# EAGLE design Pod (EAGLE 5.11)
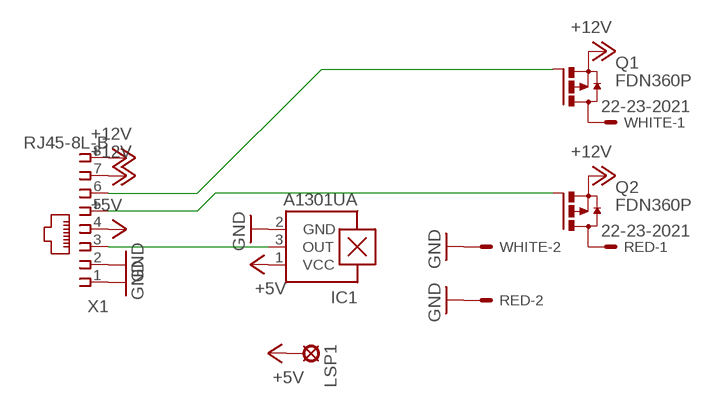
[diagram p0: schematic, sheet 1]

## Parts
IC1  A1301UA  [SIP3-UA]
LSP1  LSP10  [LSP10]
Q1  FDN360P  [SUPER-SOT3]
Q2  FDN360P  [SUPER-SOT3]
RED  22-23-2021  [22-23-2021]
WHITE  22-23-2021  [22-23-2021]
X1  RJ45-8L-B  [RJ45-NO-SHIELD]

## Nets
+5V: IC1.1(VCC) LSP1.MP X1.4
+12V: Q1.2(S) Q2.2(S) X1.7 X1.8
GND: IC1.2(GND) RED.2 WHITE.2 X1.1 X1.2
N$1: IC1.3(OUT) X1.3
N$2: Q1.3(D) WHITE.1
N$3: Q2.3(D) RED.1
N$4: Q1.1(G) X1.6
N$5: Q2.1(G) X1.5

## Library data of the parts
IC1 = allegro:A13*?: Linear Hall Effect Sensor ICs Continuous-Time Ratiometric High-Temperature Operation Programmable Linear with Analog Output A1302 -Replacement- UGN3503 Source: http://www.allegromicro.com/en/Products/Part_Numbers/1301/1301.pdf http://www.allegromicro.com/en/Products/Part_Numbers/1321/1321.pdf http://www.allegromicro.com/en/Products/Part_Numbers/1381/1381.pdf; MF: ALLEGRO MICROSYSTEMS, INC.; MPN: A1301EUA-T; OC_FARNELL: 1198085; OC_NEWARK: 31K6635
LSP1 = solpad:LSP10: SOLDER PAD drill 1.0 mm, distributor Buerklin, 12H555
Q1 Q2 = transistor-power:FDN360P: Single P-Channel, PowerTrench (R) MOSFET Source: http://www.fairchildsemi.com/ds/FD/FDN360P.pdf
RED WHITE = con-molex:22-23-2021: .100" (2.54mm) Center Header - 2 Pin; MF: MOLEX; MPN: 22-23-2021; OC_FARNELL: 1462926; OC_NEWARK: 25C3832
X1 = con-tycoelectronics:RJ45: CORCOM Modular RJ Jacks No Shield Source: www.tycoelectronics.com .. ENG_DS_1654001_1099_RJ_L_0507.pdf; MF: TYCO ELECTRONICS; MPN: RJ45-8L-B; OC_FARNELL: 1279843; OC_NEWARK: 52K4445

## Board
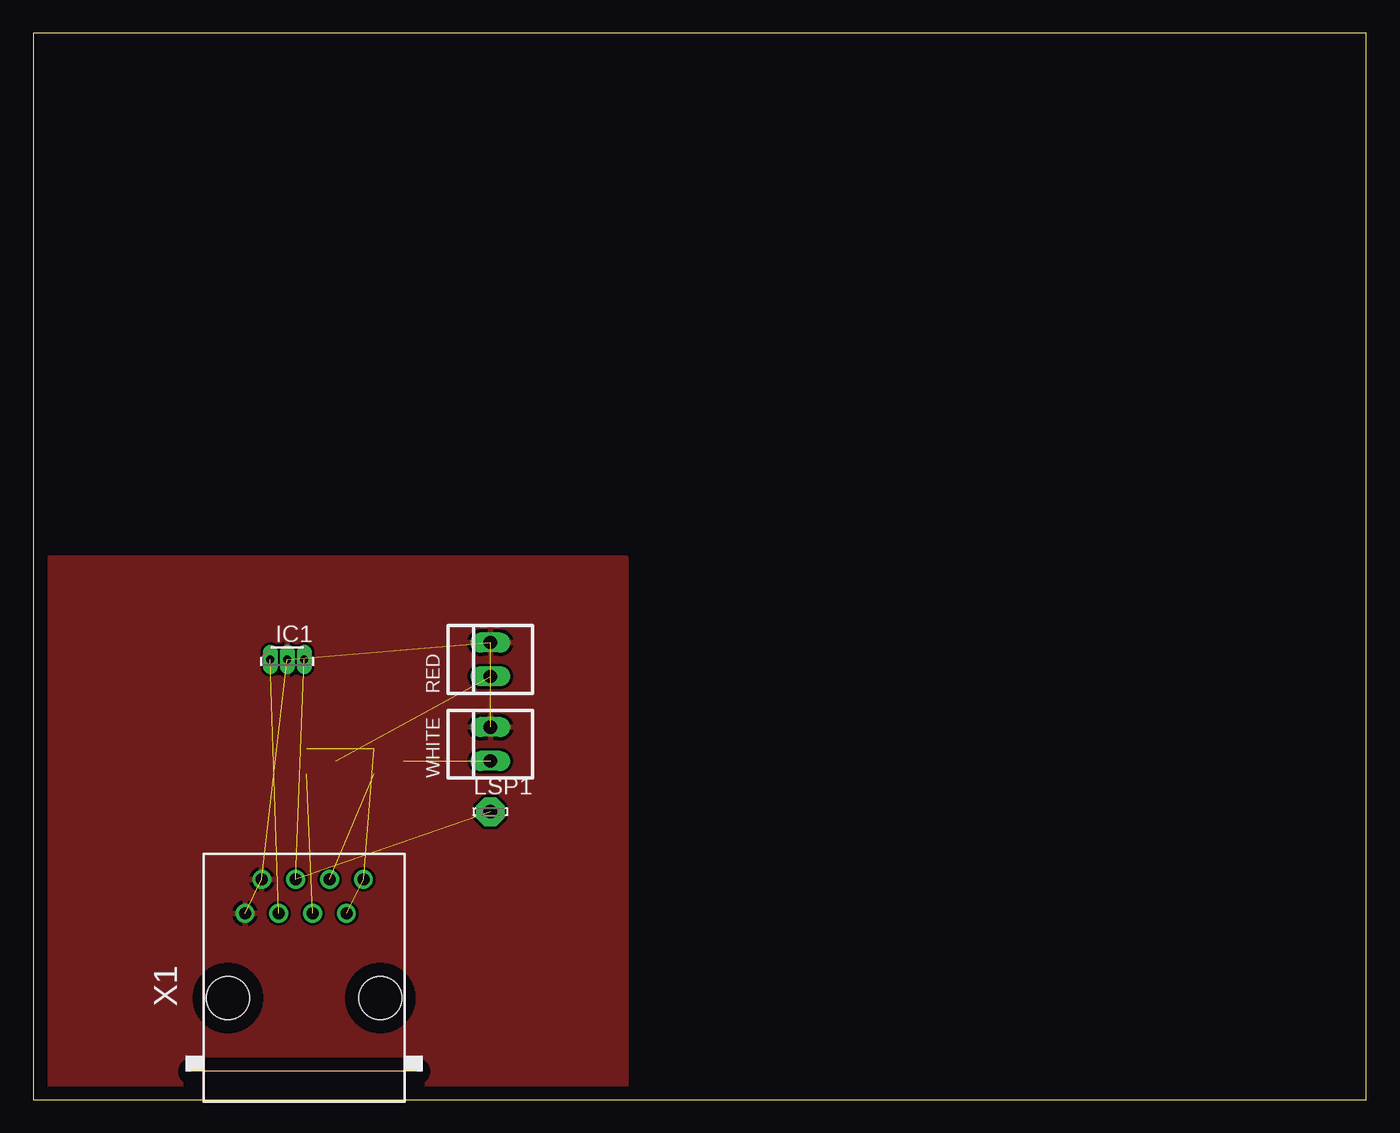
[diagram p1: board, top side]
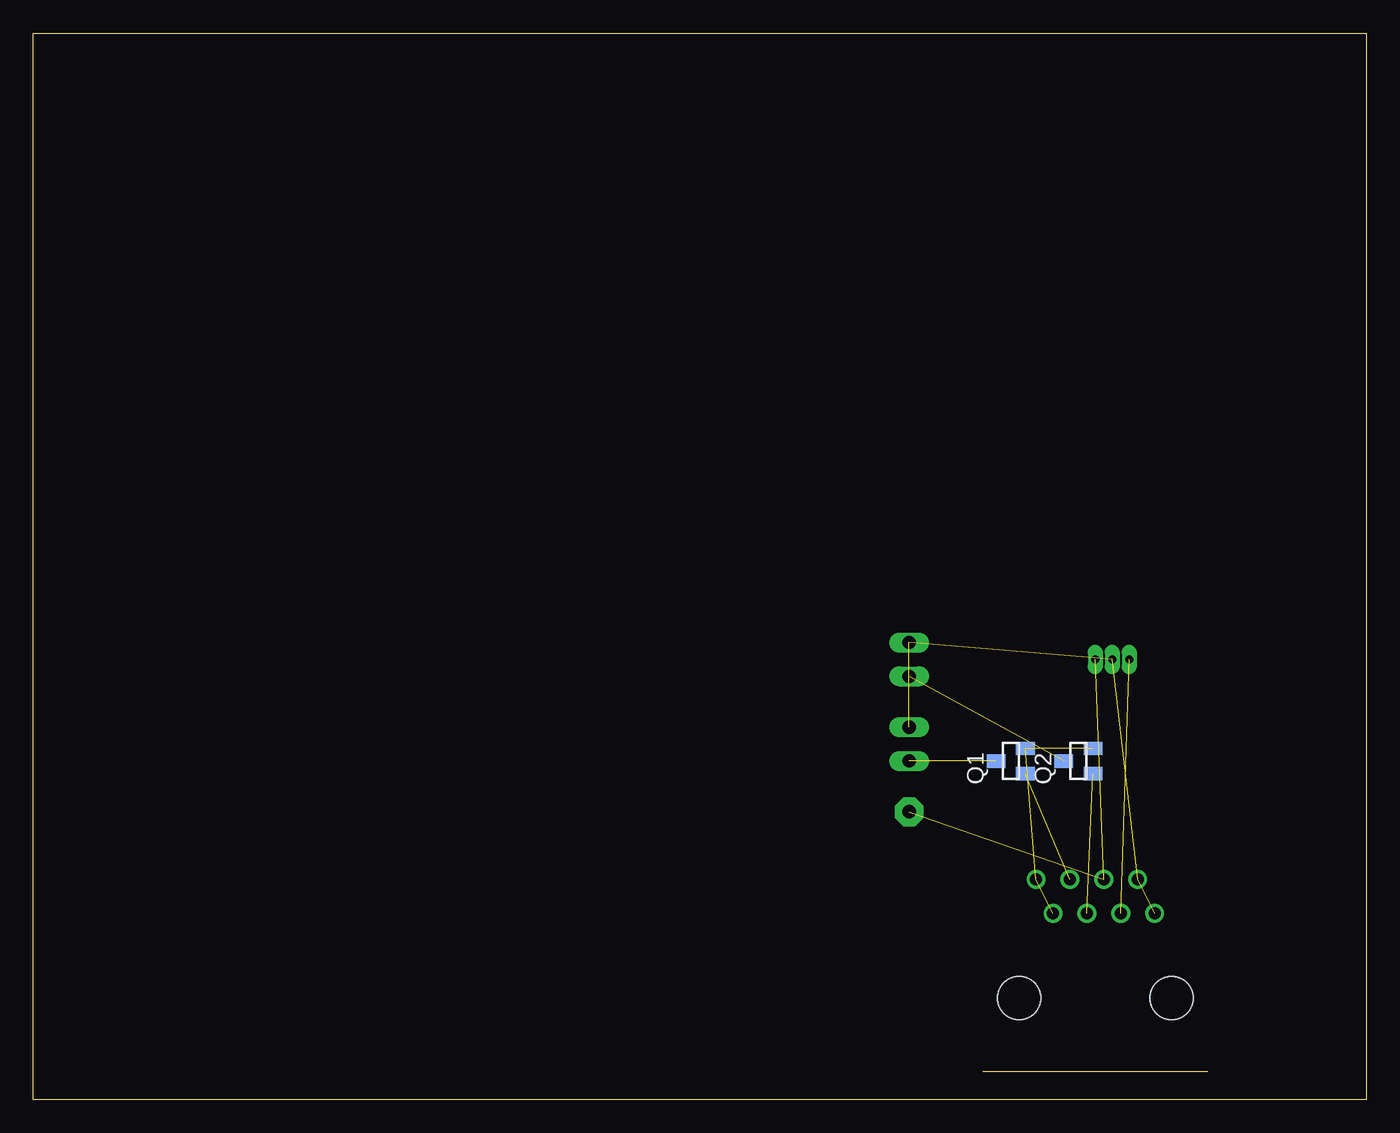
[diagram p2: board, bottom side, seen from below]

Size 100 x 80 mm. Coordinates in mm from the lower left corner, seen from the top.
Outline: 0,0 100,0 100,80 0,80 0,0
Copper layers (1*16): Top 0.035mm / dielectric 1.5mm / Bottom 0.035mm
Design rules "default": minimum track width 10mil, minimum drill 0.6mm, track to track 8mil, track to pad 8mil, pad to pad 8mil, via to via 8mil, smd to smd 8mil, copper to edge 40mil, drill to drill 8mil, minimum pad ring 10mil, minimum via ring 8mil, stop-mask expansion 4mil, vias tented up to drill 0mil, thermal gap 10mil

### Footprints (pad centres in the part's own frame; a part is rotated, then mirrored left to right if it is on the bottom)
SIP3-UA = drill 0.6 pad 0.7 long: 1 -1.27,0; 2 0,0; 3 1.27,0
LSP10 = drill 1.016 pad 2.159 octagon: MP 0,0
SUPER-SOT3 = smd 1 x 1.4: 1 -0.95,-1.1; 2 0.95,-1.1; 3 0,1.1
22-23-2021 = drill 1 long: 1 -1.27,0; 2 1.27,0
RJ45-NO-SHIELD = drill 0.9 pad 1.4 round: 1 -4.445,6.35; 2 -3.175,8.89; 3 -1.905,6.35; 4 -0.635,8.89; 5 0.635,6.35; 6 1.905,8.89; 7 3.175,6.35; 8 4.445,8.89 | hole 3.251: -5.715,0; 5.715,0

### Placement (x,y rotation side)
IC1  19.05,33.02 180 top
LSP1  34.29,21.59 0 top
Q1  26.67,25.4 90 bottom
Q2  21.59,25.4 90 bottom
RED  34.29,33.02 90 top
WHITE  34.29,26.67 90 top
X1  20.32,7.62 0 top

### Tracks (layer width: path | path; a pad name or v marks a point on that pad's centre or on a via)
+5V  (2 unrouted)
+12V  (3 unrouted)
GND  (4 unrouted)
  pour Top: 1.27,40.64 44.45,40.64 44.45,-1.27 1.27,-1.27
N$1  (1 unrouted)
N$2  (1 unrouted)
N$3  (1 unrouted)
N$4  (1 unrouted)
N$5  (1 unrouted)